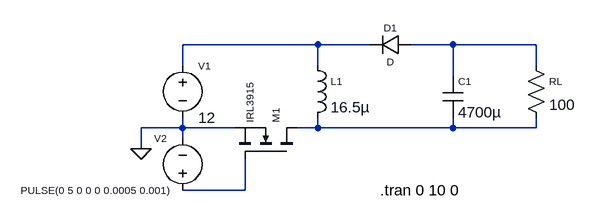
[diagram p0: schematic proto.asc]
proto.asc, the LTspice schematic file:
Version 4
SHEET 1 880 680
WIRE 256 48 48 48
WIRE 336 48 256 48
WIRE 464 48 400 48
WIRE 592 48 464 48
WIRE 48 80 48 48
WIRE 256 80 256 48
WIRE 592 80 592 48
WIRE 464 96 464 48
WIRE 48 176 48 160
WIRE 48 176 -16 176
WIRE 128 176 48 176
WIRE 256 176 256 160
WIRE 256 176 224 176
WIRE 464 176 464 160
WIRE 464 176 256 176
WIRE 592 176 592 160
WIRE 592 176 464 176
WIRE 48 192 48 176
WIRE -16 208 -16 176
WIRE 144 272 144 224
WIRE 144 272 48 272
FLAG -16 208 0
SYMBOL voltage 48 64 R0
WINDOW 123 0 0 Left 0
WINDOW 39 0 0 Left 0
WINDOW 0 24 16 Left 1
SYMATTR InstName V1
SYMATTR Value 12
SYMBOL voltage 48 288 R180
WINDOW 0 24 96 Left 1
WINDOW 3 24 16 Left 1
WINDOW 123 0 0 Left 0
WINDOW 39 0 0 Left 0
SYMATTR InstName V2
SYMATTR Value PULSE(0 5 0 0 0 0.0005 0.001)
SYMBOL ind 240 64 R0
WINDOW 0 36 40 Left 1
SYMATTR InstName L1
SYMATTR Value 16.5µ
SYMBOL cap 448 96 R0
WINDOW 0 24 8 Left 1
SYMATTR InstName C1
SYMATTR Value 4700µ
SYMATTR SpiceLine V=50
SYMBOL diode 400 32 R90
WINDOW 0 0 32 VBottom 1
WINDOW 3 32 32 VTop 1
SYMATTR InstName D1
SYMBOL res 576 64 R0
WINDOW 0 36 40 Left 1
SYMATTR InstName RL
SYMATTR Value 100
SYMBOL nmos 224 224 M270
WINDOW 0 56 32 Left 1
WINDOW 3 56 72 Left 1
SYMATTR InstName M1
SYMATTR Value IRL3915
TEXT 352 272 Left 2 !.tran 0 10 0

The netlist it stands for:
* proto.asc
V1 N001 0 12
V2 N004 0 PULSE(0 5 0 0 0 0.0005 0.001)
L1 N001 N003 16.5µ
C1 N002 N003 4700µ V=50
D1 N002 N001 D
RL N002 N003 100
M1 N003 N004 0 0 IRL3915
.model D D
.lib standard.dio
.model NMOS NMOS
.model PMOS PMOS
.lib standard.mos
.tran 0 10 0
.backanno
.end